# EAGLE design RS232_HCPL2730 (EAGLE 7.7.0)
RS232 Adapter using HCPL2730 Optocouplers Powered by PIC
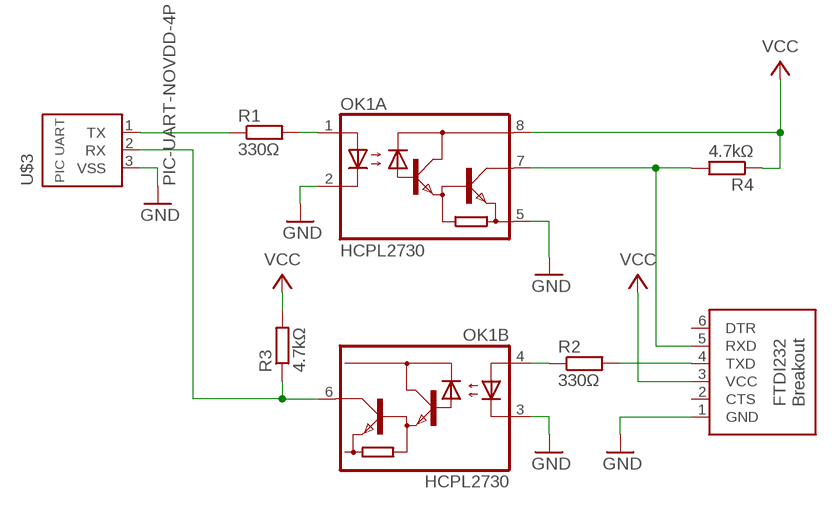
[diagram p0: schematic, sheet 1]

## Parts
OK1  HCPL2730  [DIL08]
R1  330Ω  R-EU_0207/10  [0207/10]
R2  330Ω  R-EU_0204/7  [0204/7]
R3  4.7kΩ  R-EU_0204/7  [0204/7]
R4  4.7kΩ  R-EU_0204/7  [0204/7]
U$2  FTDI232-BO-6P  [CONN-6P]
U$3  PIC-UART-NOVDD-4P  [CONN-4P]

## Nets
GND: OK1.2(A:C1) OK1.3(B:C2) OK1.5(A:GND) U$2.1(GND) U$3.3(VSS)
N$1: OK1.1(A:A1) R1.2
N$2: R1.1 U$3.1(TX)
N$3: OK1.4(B:A2) R2.1
N$4: R2.2 U$2.4(TXD)
N$5: OK1.6(B:VO2) R3.1 U$3.2(RX)
N$6: OK1.7(A:VO1) R4.2 U$2.5(RXD)
VCC: OK1.8(A:VCC) R3.2 R4.1 U$2.3(VCC)
Unconnected: U$2.2(CTS) U$2.6(DTR)

## Library data of the parts
OK1 = optocoupler:HCPL2730: HEWLETT PACKARD OPTO COUPLER; MF: AGILENT TECHNOLOGIES; MPN: HCPL-2730-000E; OC_FARNELL: 9994840; OC_NEWARK: 88H7816
R1-R4 = resistor:R-EU_: RESISTOR, European symbol
U$2 = pinconn:FTDI232-BO
U$3 = pinconn:PIC-UART-NOVDD

## Board
RS232 Adapter using HCPL2730 Optocouplers Powered by PIC
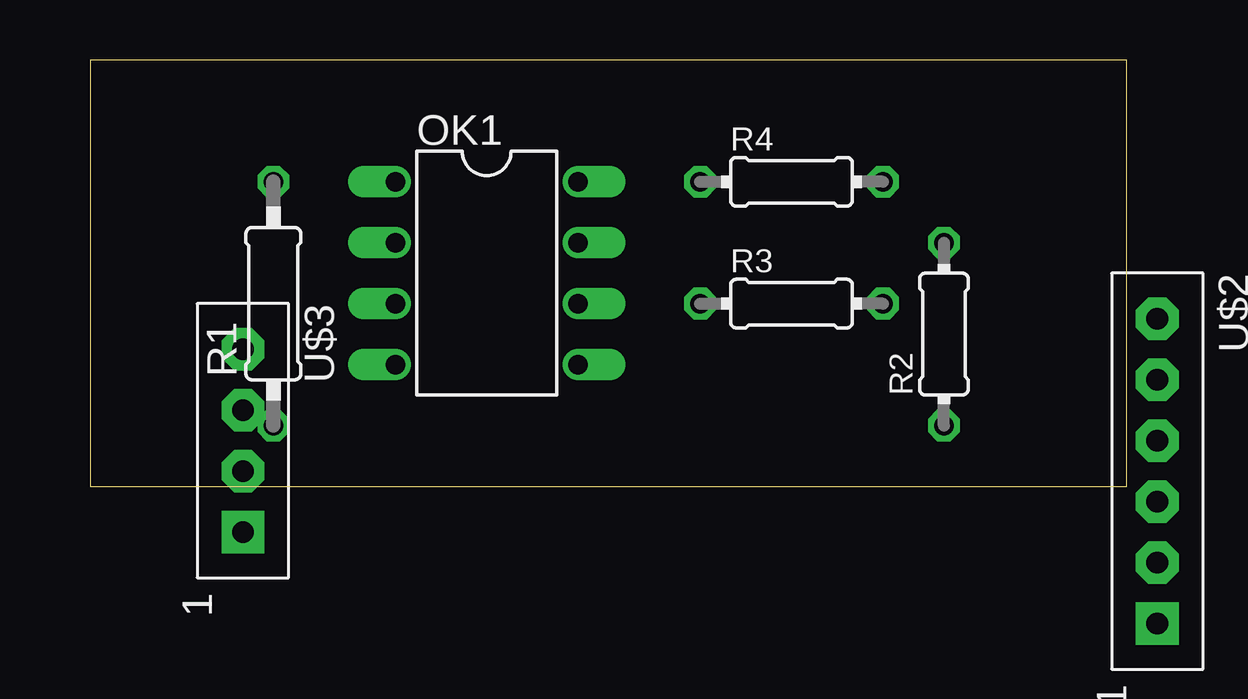
[diagram p1: board, top side]
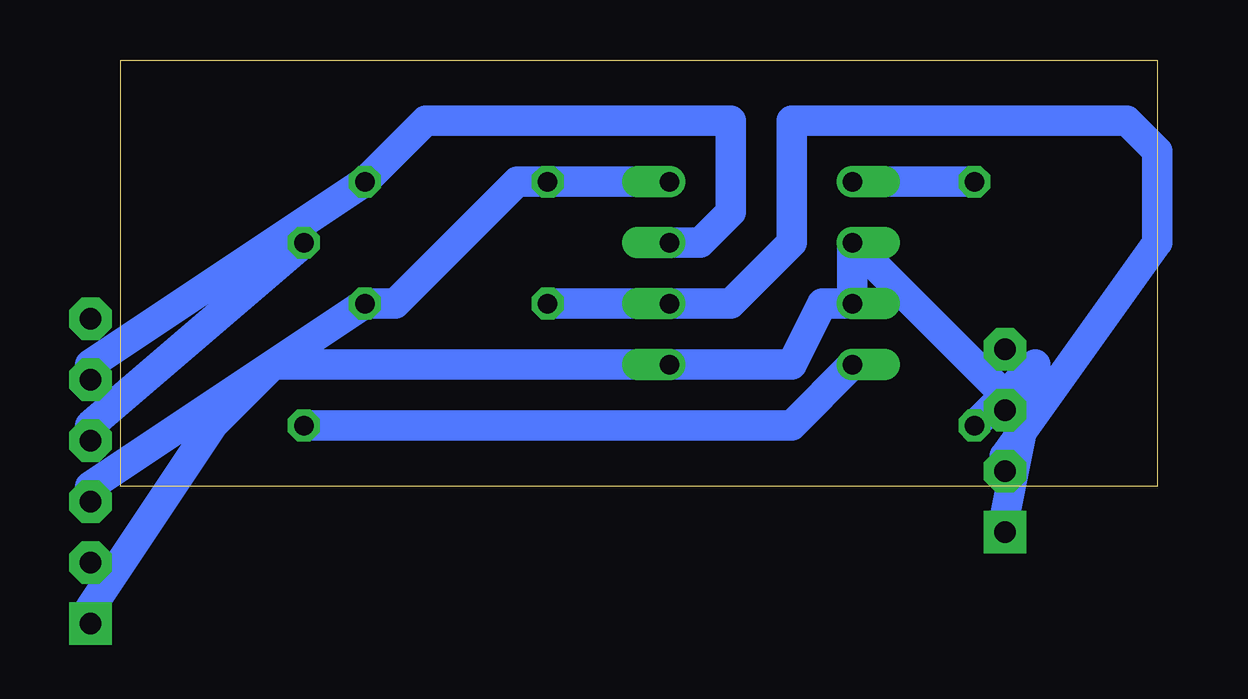
[diagram p2: board, bottom side, seen from below]

Size 43.18 x 17.78 mm. Coordinates in mm from the lower left corner, seen from the top.
Outline: 0,0 43.18,0 43.18,17.78 0,17.78 0,0
Copper layers (1*16): Top 0.035mm / dielectric 1.5mm / Bottom 0.035mm
Design rules "default": minimum track width 10mil, minimum drill 24mil, track to track 8mil, track to pad 8mil, pad to pad 8mil, via to via 8mil, smd to smd 8mil, copper to edge 40mil, drill to drill 8mil, minimum pad ring 10mil, minimum via ring 8mil, stop-mask expansion 4mil, vias tented up to drill 0mil, thermal gap 10mil

### Footprints (pad centres in the part's own frame; a part is rotated, then mirrored left to right if it is on the bottom)
DIL08 = drill 0.813 offset: 1 -3.81,-3.81; 2 -1.27,-3.81; 3 1.27,-3.81; 4 3.81,-3.81; 5 3.81,3.81; 6 1.27,3.81; 7 -1.27,3.81; 8 -3.81,3.81
0207/10 = drill 0.813 octagon: 1 -5.08,0; 2 5.08,0
0204/7 = drill 0.813 octagon: 1 -3.81,0; 2 3.81,0
CONN-6P = drill 0.9 pad 1.778 square: 1 14.605,3.81 | drill 0.9 pad 1.778 octagon: 2 12.065,3.81; 3 9.525,3.81; 4 6.985,3.81; 5 4.445,3.81; 6 1.905,3.81
CONN-4P = drill 0.9 pad 1.778 square: 1 9.525,3.81 | drill 0.9 pad 1.778 octagon: 2 6.985,3.81; 3 4.445,3.81; 4 1.905,3.81

### Placement (x,y rotation side)
OK1  16.51,8.89 270 top
R1  7.62,7.62 90 top
R2  35.56,6.35 90 top
R3  29.21,7.62 0 top
R4  29.21,12.7 0 top
U$2  40.64,8.89 270 top
U$3  2.54,7.62 270 top

### Tracks (layer width: path | path; a pad name or v marks a point on that pad's centre or on a via)
GND
  Bottom 1.27: 6.35,3.81 OK1.2 OK1.3 13.97,7.62 15.24,5.08 OK1.5 36.83,5.08 39.37,2.54 44.45,-5.08
N$1
  Bottom 1.27: R1.2 OK1.1
N$2
  Bottom 1.27: 6.35,-1.27 5.08,5.08 R1.1
N$3
  Bottom 1.27: R2.1 15.24,2.54 OK1.4 11.43,5.08
N$4
  Bottom 1.27: 44.45,2.54 R2.2
N$5
  Bottom 1.27: R3.1 OK1.6 17.78,7.62 15.24,10.16 15.24,15.24 1.27,15.24 0,13.97 0,10.16 6.35,1.27
N$6
  Bottom 1.27: OK1.7 19.05,10.16 17.78,11.43 17.78,15.24 30.48,15.24 R4.2 44.45,5.08
VCC
  Bottom 1.27: OK1.8 R4.1 26.67,12.7 31.75,7.62 R3.2 44.45,0